# EAGLE design Un_Bus_B (EAGLE 7.1.0)
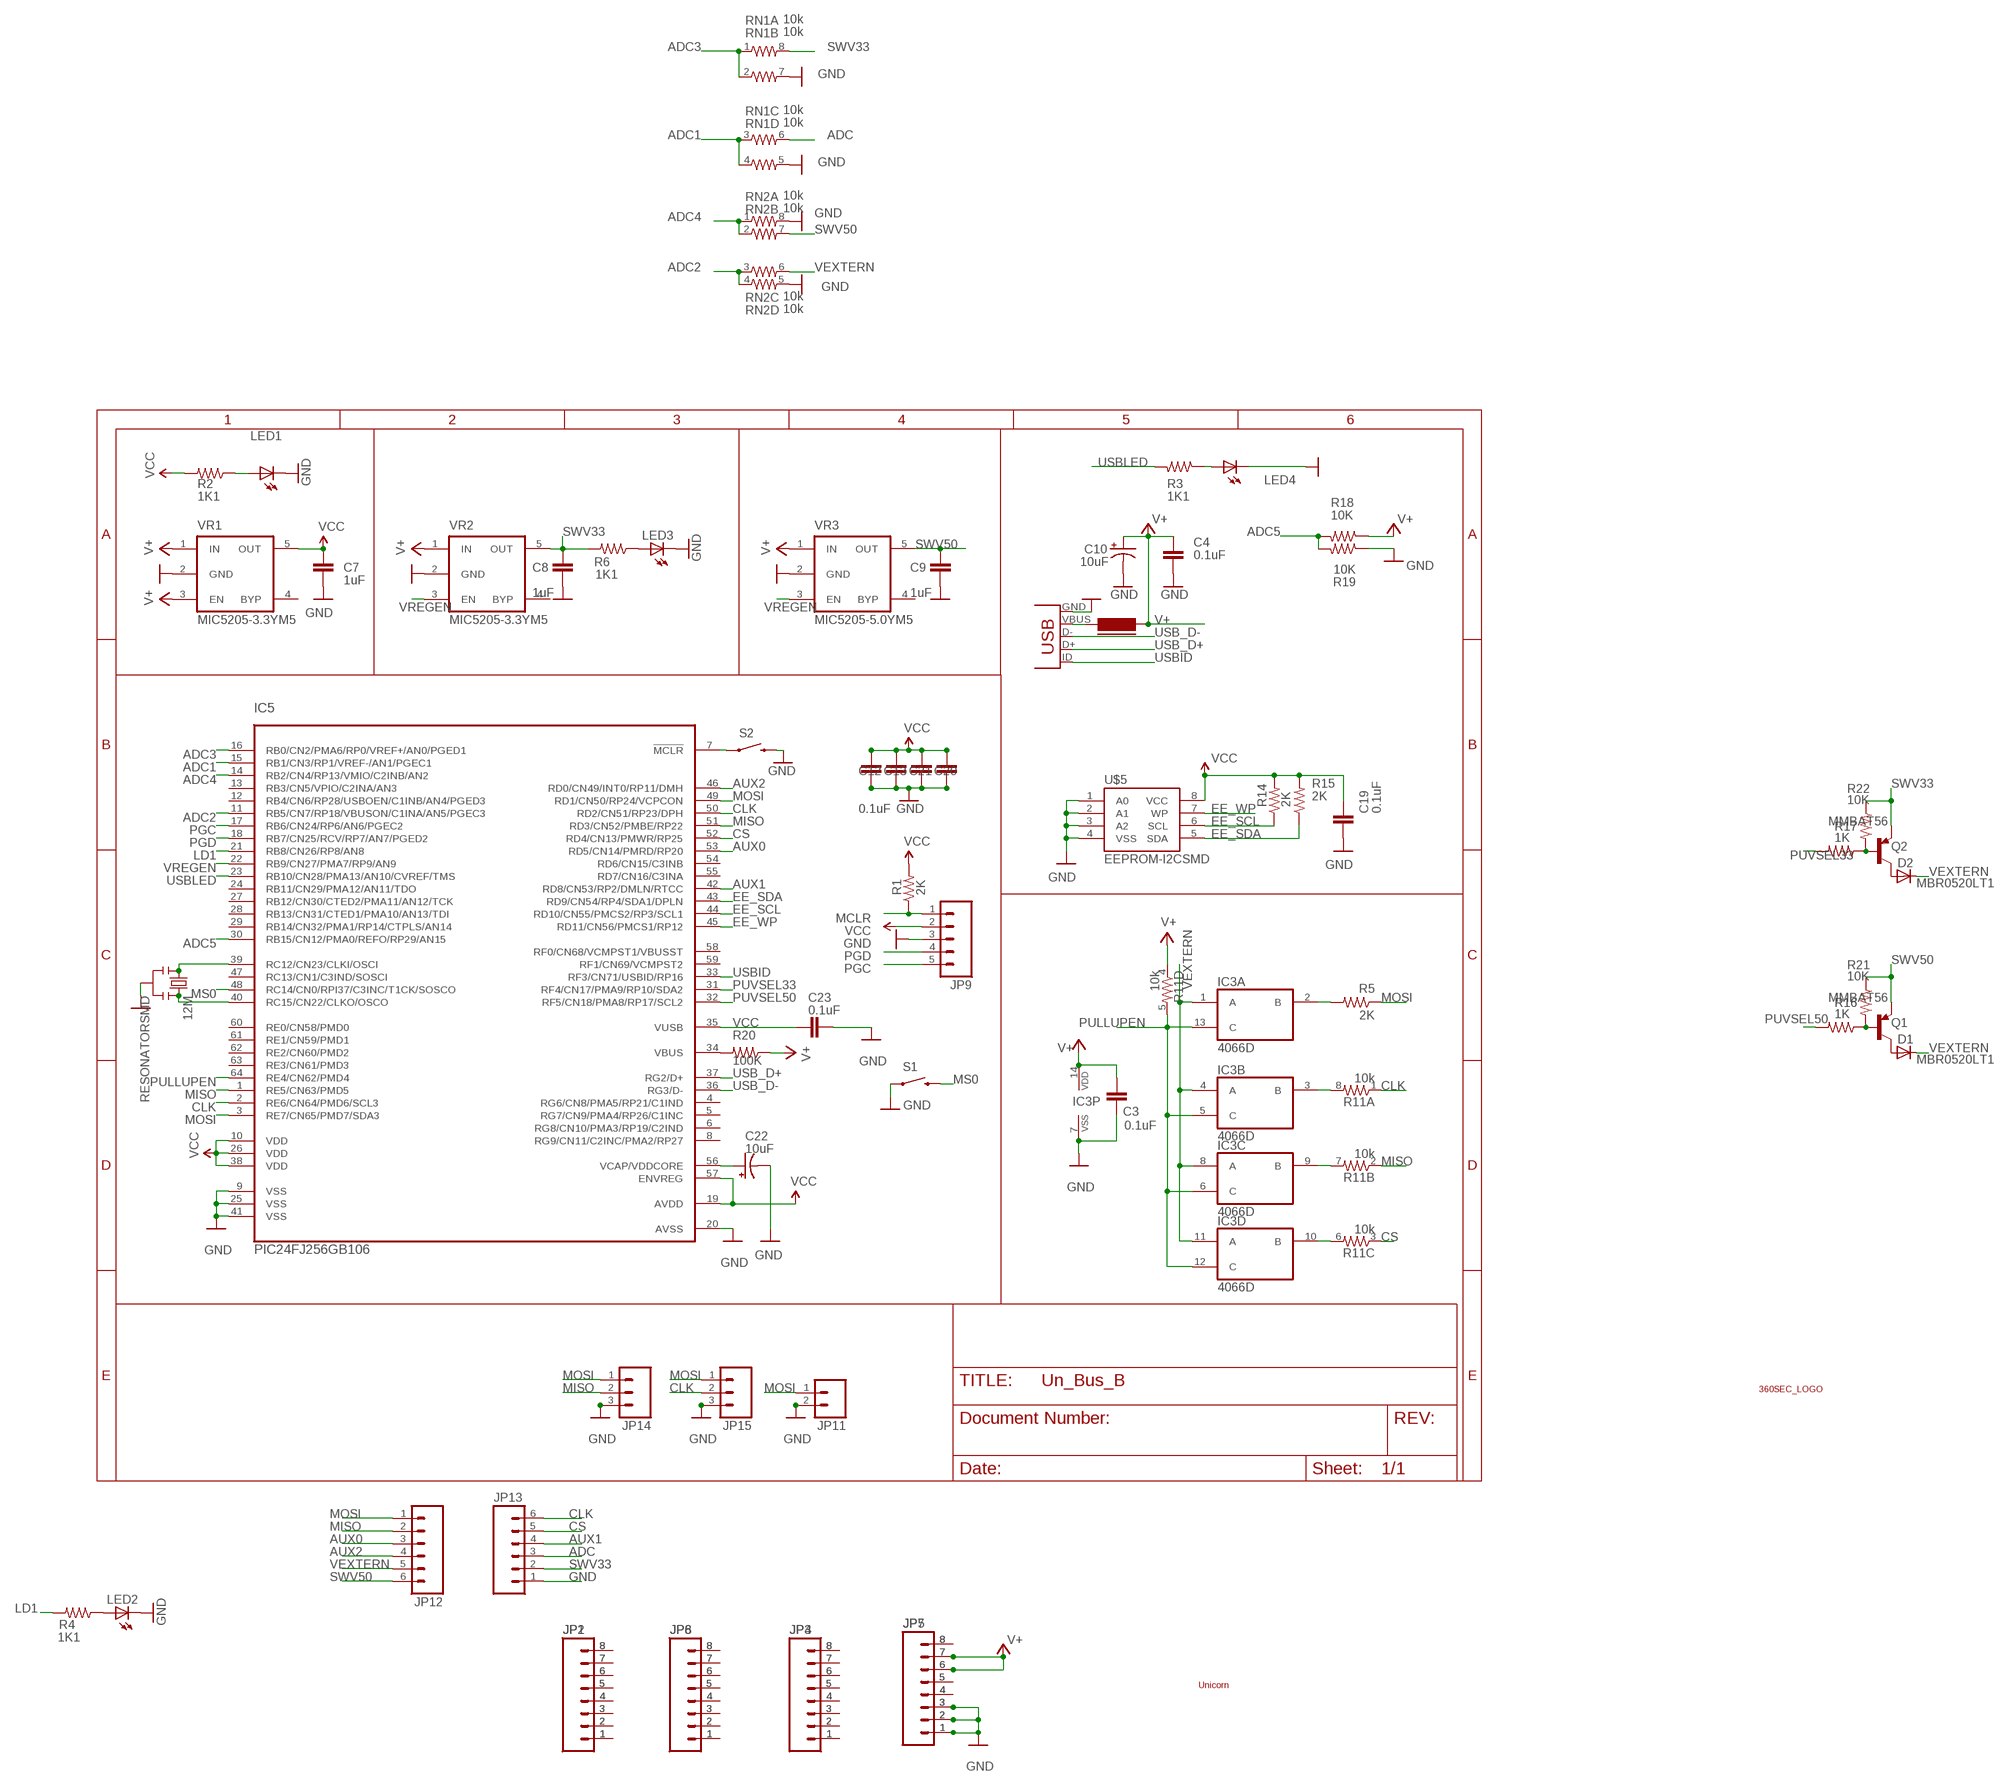
[diagram p0: schematic, sheet 1]

## Parts
12M  RESONATORSMD  [RESONATOR-SMD]
C3  0.1uF  CAP0603-CAP  [0603-CAP]
C4  0.1uF  CAP0603-CAP  [0603-CAP]
C7  1uF  CAP0603-CAP  [0603-CAP]
C8  1uF  CAP0603-CAP  [0603-CAP]
C9  1uF  CAP0603-CAP  [0603-CAP]
C10  10uF  CAP_POL1206  [EIA3216]
C12  0.1uF  CAP0603-CAP  [0603-CAP]
C13  0.1uF  CAP0603-CAP  [0603-CAP]
C19  0.1uF  CAP0603-CAP  [0603-CAP]
C20  0.1uF  CAP0603-CAP  [0603-CAP]
C21  0.1uF  CAP0603-CAP  [0603-CAP]
C22  10uF  CAP_POL1206  [EIA3216]
C23  0.1uF  CAP0603-CAP  [0603-CAP]
D1  MBR0520LT1  MBR0520LT  [SOD123]
D2  MBR0520LT1  MBR0520LT  [SOD123]
IC3  4066D  [SO14]
IC5  PIC24FJ256GB106  [TQFP64-10X10]
JP1  M081X08  [1X08]
JP2  M081X08  [1X08]
JP3  M081X08  [1X08]
JP4  M081X08  [1X08]
JP5  M081X08  [1X08]
JP6  M081X08  [1X08]
JP7  M081X08  [1X08]
JP8  M081X08  [1X08]
JP9  M05PTH  [1X05]
JP11  M02PTH  [1X02]
JP12  M06SIP  [1X06]
JP13  M06SIP  [1X06]
JP14  M03PTH  [1X03]
JP15  M03PTH  [1X03]
L1  700mA+ ferrite  FERRITE-0805  [FB805]
LED1  LED0805  [LED-0805]
LED2  LED0805  [LED-0805]
LED3  LED0805  [LED-0805]
LED4  LED0805  [LED-0805]
Q1  MMBAT56  MMBTA56-SOT23  [SOT23]
Q2  MMBAT56  MMBTA56-SOT23  [SOT23]
R1  2K  RESISTOR0603-RES  [0603-RES]
R2  1K1  RESISTOR0603-RES  [0603-RES]
R3  1K1  RESISTOR0603-RES  [0603-RES]
R4  1K1  RESISTOR0603-RES  [0603-RES]
R5  2K  RESISTOR0603-RES  [0603-RES]
R6  1K1  RESISTOR0603-RES  [0603-RES]
R11  10k  RESISTOR-ARRAY  [RES-NET-0603]
R14  2K  RESISTOR0603-RES  [0603-RES]
R15  2K  RESISTOR0603-RES  [0603-RES]
R16  1K  RESISTOR0603-RES  [0603-RES]
R17  1K  RESISTOR0603-RES  [0603-RES]
R18  10K  RESISTOR0603-RES  [0603-RES]
R19  10K  RESISTOR0603-RES  [0603-RES]
R20  100K  RESISTOR0603-RES  [0603-RES]
R21  10K  RESISTOR0603-RES  [0603-RES]
R22  10K  RESISTOR0603-RES  [0603-RES]
RN1  10k  RESISTOR-ARRAY  [RES-NET-0603]
RN2  10k  RESISTOR-ARRAY  [RES-NET-0603]
S1  SWITCH-MOMENTARY-2-SMD-1101NE  [TACTILE-SWITCH-1101NE]
S2  SWITCH-MOMENTARY-2-SMD-1101NE  [TACTILE-SWITCH-1101NE]
U$1  UNICORN  [UNICORN_1]
U$3  360SEC_LOGO_1  [360SEC_1]
U$5  EEPROM-I2CSMD  [SO08]
VR1  MIC5205-3.3YM5  MIC5205  [SOT-23-5]
VR2  MIC5205-3.3YM5  MIC5205  [SOT-23-5]
VR3  MIC5205-5.0YM5  MIC5205  [SOT-23-5]
X1  USBSMD  [USB-MINIB]

## Nets
ADC: JP13.3 RN1.6
ADC1: IC5.15(RB1/CN3/RP1/VREF-/AN1/PGEC1) RN1.3 RN1.4
ADC2: IC5.11(RB5/CN7/RP18/VBUSON/C1INA/AN5/PGEC3) RN2.3 RN2.4
ADC3: IC5.16(RB0/CN2/PMA6/RP0/VREF+/AN0/PGED1) RN1.1 RN1.2
ADC4: IC5.14(RB2/CN4/RP13/VMIO/C2INB/AN2) RN2.1 RN2.2
ADC5: IC5.30(RB15/CN12/PMA0/REFO/RP29/AN15) R18.2 R19.2
AUX0: IC5.53(RD5/CN14/PMRD/RP20) JP12.3
AUX1: IC5.42(RD8/CN53/RP2/DMLN/RTCC) JP13.4
AUX2: IC5.46(RD0/CN49/INT0/RP11/DMH) JP12.4
CLK: IC5.2(RE6/CN64/PMD6/SCL3) IC5.50(RD2/CN51/RP23/DPH) JP13.6 JP15.2 R11.1
CS: IC5.52(RD4/CN13/PMWR/RP25) JP13.5 R11.3
EE_SCL: IC5.44(RD10/CN55/PMCS2/RP3/SCL1) R14.1 U$5.6(SCL)
EE_SDA: IC5.43(RD9/CN54/RP4/SDA1/DPLN) R15.1 U$5.5(SDA)
EE_WP: IC5.45(RD11/CN56/PMCS1/RP12) U$5.7(WP)
GND: 12M.2 C3.2 C4.2 C7.2 C8.2 C9.2 C10.C(-) C12.2 C13.2 C19.1 C20.2 C21.2 C22.C(-) C23.2 IC3.7(P:VSS) IC5.9(VSS) IC5.20(AVSS) IC5.25(VSS) IC5.41(VSS) JP5.1 JP5.2 JP5.3 JP7.1 JP7.2 JP7.3 JP9.3 JP11.2 JP13.1 JP14.3 JP15.3 LED1.2(C) LED2.2(C) LED3.2(C) LED4.2(C) R19.1 RN1.5 RN1.7 RN2.5 RN2.8 S1.P$1 S2.P$2 U$5.1(A0) U$5.2(A1) U$5.3(A2) U$5.4(VSS) VR1.2(GND) VR2.2(GND) VR3.2(GND) X1.GND
LD1: IC5.21(RB8/CN26/RP8/AN8) R4.2
MCLR: IC5.7(!MCLR) JP9.1 R1.1 S2.P$1
MISO: IC5.1(RE5/CN63/PMD5) IC5.51(RD3/CN52/PMBE/RP22) JP12.2 JP14.2 R11.2
MOSI: IC5.3(RE7/CN65/PMD7/SDA3) IC5.49(RD1/CN50/RP24/VCPCON) JP11.1 JP12.1 JP14.1 JP15.1 R5.1
MS0: IC5.48(RC14/CN0/RPI37/C3INC/T1CK/SOSCO) S1.P$2
N$1: IC3.2(A:B) R5.2
N$2: IC3.3(B:B) R11.8
N$4: IC3.10(D:B) R11.6
N$5: IC3.9(C:B) R11.7
N$6: LED2.1(A) R4.1
N$7: LED1.1(A) R2.1
N$8: JP1.1 JP2.1
N$10: JP1.2 JP2.2
N$11: JP1.3 JP2.3
N$12: JP1.4 JP2.4
N$13: LED4.1(A) R3.1
N$14: JP1.5 JP2.5
N$17: JP1.6 JP2.6
N$18: LED3.1(A) R6.1
N$19: JP1.7 JP2.7
N$20: JP1.8 JP2.8
N$21: JP3.1 JP4.1
N$22: JP3.2 JP4.2
N$23: JP3.3 JP4.3
N$24: JP3.4 JP4.4
N$25: JP3.5 JP4.5
N$26: JP3.6 JP4.6
N$27: JP3.7 JP4.7
N$28: JP3.8 JP4.8
N$30: L1.1 X1.VBUS
N$31: JP5.4 JP7.4
N$32: JP6.1 JP8.1
N$33: JP5.5 JP7.5
N$34: JP6.2 JP8.2
N$35: JP6.3 JP8.3
N$36: JP6.4 JP8.4
N$37: JP6.5 JP8.5
N$38: JP6.6 JP8.6
N$39: JP6.7 JP8.7
N$40: JP6.8 JP8.8
N$49: C22.A(+) IC5.56(VCAP/VDDCORE)
N$50: IC5.34(VBUS) R20.2
N$51: 12M.3 IC5.40(RC15/CN22/CLKO/OSCO)
N$52: 12M.1 IC5.39(RC12/CN23/CLKI/OSCI)
N$53: D1.A Q1.3(C)
N$54: D2.A Q2.3(C)
N$55: Q1.1(B) R16.1 R21.2
N$56: Q2.1(B) R17.1 R22.2
PGC: IC5.17(RB6/CN24/RP6/AN6/PGEC2) JP9.5
PGD: IC5.18(RB7/CN25/RCV/RP7/AN7/PGED2) JP9.4
PULLUPEN: IC3.5(B:C) IC3.6(C:C) IC3.12(D:C) IC3.13(A:C) IC5.64(RE4/CN62/PMD4) R11.5
PUVSEL33: IC5.31(RF4/CN17/PMA9/RP10/SDA2) R17.2
PUVSEL50: IC5.32(RF5/CN18/PMA8/RP17/SCL2) R16.2
RST: JP5.8 JP7.8
SWV33: C8.1 JP13.2 Q2.2(E) R6.2 R22.1 RN1.8 VR2.5(OUT)
SWV50: C9.1 JP12.6 Q1.2(E) R21.1 RN2.7 VR3.5(OUT)
USB_D+: IC5.37(RG2/D+) X1.D+
USB_D-: IC5.36(RG3/D-) X1.D-
USBID: IC5.33(RF3/CN71/USBID/RP16) X1.ID(USBID)
USBLED: IC5.23(RB10/CN28/PMA13/AN10/CVREF/TMS) R3.2
V+: C3.1 C4.1 C10.A(+) IC3.14(P:VDD) JP5.6 JP5.7 JP7.6 JP7.7 L1.2 R11.4 R18.1 R20.1 VR1.1(IN) VR1.3(EN) VR2.1(IN) VR3.1(IN)
VCC: C7.1 C12.1 C13.1 C19.2 C20.1 C21.1 C23.1 IC5.10(VDD) IC5.19(AVDD) IC5.26(VDD) IC5.35(VUSB) IC5.38(VDD) IC5.57(ENVREG) JP9.2 R1.2 R2.2 R14.2 R15.2 U$5.8(VCC) VR1.5(OUT)
VEXTERN: D1.C D2.C IC3.1(A:A) IC3.4(B:A) IC3.8(C:A) IC3.11(D:A) JP12.5 RN2.6
VREGEN: IC5.22(RB9/CN27/PMA7/RP9/AN9) VR2.3(EN) VR3.3(EN)
Unconnected: IC5.4(RG6/CN8/PMA5/RP21/C1IND) IC5.5(RG7/CN9/PMA4/RP26/C1INC) IC5.6(RG8/CN10/PMA3/RP19/C2IND) IC5.8(RG9/CN11/C2INC/PMA2/RP27) IC5.12(RB4/CN6/RP28/USBOEN/C1INB/AN4/PGED3) IC5.13(RB3/CN5/VPIO/C2INA/AN3) IC5.24(RB11/CN29/PMA12/AN11/TDO) IC5.27(RB12/CN30/CTED2/PMA11/AN12/TCK) IC5.28(RB13/CN31/CTED1/PMA10/AN13/TDI) IC5.29(RB14/CN32/PMA1/RP14/CTPLS/AN14) IC5.47(RC13/CN1/C3IND/SOSCI) IC5.54(RD6/CN15/C3INB) IC5.55(RD7/CN16/C3INA) IC5.58(RF0/CN68/VCMPST1/VBUSST) IC5.59(RF1/CN69/VCMPST2) IC5.60(RE0/CN58/PMD0) IC5.61(RE1/CN59/PMD1) IC5.62(RE2/CN60/PMD2) IC5.63(RE3/CN61/PMD3) VR1.4(BYP) VR2.4(BYP) VR3.4(BYP)

## Library data of the parts
12M = 2SparkFun:RESONATOR: Resonator Small SMD resonator. This is the itty bitty 10/20MHz resonators with built in caps. CSTCE10M0G55 and CSTCE20M0V53. Footprint has been reviewed closely but hasn't been tested yet.
C3 C4 C7-C9 C12 C13 C19-C21 C23 = 2SparkFun:CAP: Capacitor Standard 0603 ceramic capacitor, and 0.1" leaded capacitor.
C10 C22 = 2SparkFun:CAP_POL: Capacitor Polarized These are standard SMD and PTH capacitors. Normally 10uF, 47uF, and 100uF in electrolytic and tantalum varieties. Always verify the external diameter of the through hole cap, it varies with capacity, voltage, and manufacturer. The EIA devices should be standard.
D1 D2 = diode:MBR0520LT: SCHOTTKY BARRIER RECTIFIER Source: http://onsemi.com .. MBR0520LT1-D.pdf
IC3 = 40xx:4066: Quad bilateral ANALOG SWITCH
IC5 = dp_devices:PIC24FJ256GB106: 16-Bit Flash Microcontroller with USB On-The-Go(OTG)
JP1-JP8 = 2SparkFun:M08: Header 8 Standard 8-pin 0.1" header. Use with straight break away headers (SKU : PRT-00116), right angle break away headers (PRT-00553), swiss pins (PRT-00743), machine pins (PRT-00117), and female headers (PRT-00115).
JP9 = 2SparkFun:M05: Header 5 Standard 5-pin 0.1" header. Use with straight break away headers (SKU : PRT-00116), right angle break away headers (PRT-00553), swiss pins (PRT-00743), machine pins (PRT-00117), and female headers (PRT-00115). Molex polarized connector foot print use with SKU : PRT-08230 with associated crimp pins and housings.
JP11 = 2SparkFun:M02: Header 2 Standard 2-pin 0.1" header. Use with straight break away headers (SKU : PRT-00116), right angle break away headers (PRT-00553), swiss pins (PRT-00743), machine pins (PRT-00117), and female headers (PRT-00115). Molex polarized connector foot print use with SKU : PRT-08233 with associated crimp pins and housings.
JP12 JP13 = 2SparkFun:M06: Header 6 Standard 6-pin 0.1" header. Use with straight break away headers (SKU : PRT-00116), right angle break away headers (PRT-00553), swiss pins (PRT-00743), machine pins (PRT-00117), and female headers (PRT-00115). Molex polarized connector foot print use with SKU : PRT-08094 with associated crimp pins and housings. NOTES ON THE VARIANTS LOCK and LOCK_LONGPADS... This footprint was designed to help hold the alignment of a through-hole component (i.e. 6-pin header) while soldering it into place. You may notice that each hole has been shifted either up or down by 0.005 of an inch from it's more standard position (which is a perfectly straight line). This slight alteration caused the pins (the squares in the middle) to touch the edges of the holes. Because they are alternating, it causes a "brace" to hold the component in place. 0.005 has proven to be the perfect amount of "off-center" position when using our standard breakaway headers. Although looks a little odd when you look at the bare footprint, once you have a header in there, the alteration is very hard to notice. Also, if you push a header all the way into place, it is covered up entirely on the bottom side. This idea of altering the position of holes to aid alignment will be further integrated into the Sparkfun Library for other footprints. It can help hold any component with 3 or more connection pins.
JP14 JP15 = 2SparkFun:M03: Header 3 Standard 3-pin 0.1" header. Use with straight break away headers (SKU : PRT-00116), right angle break away headers (PRT-00553), swiss pins (PRT-00743), machine pins (PRT-00117), and female headers (PRT-00115). Molex polarized connector foot print use with SKU : PRT-08232 with associated crimp pins and housings.
L1 = 2SparkFun:FERRITE: Ferrite bead in various packages
LED1-LED4 = 2SparkFun:LED: LEDs Standard schematic elements and footprints for 5mm, 3mm, 1206, and 0603 sized LEDs. 5mm - Spark Fun Electronics SKU : COM-00529 (and others)
Q1 Q2 = transistor-pnp:*-?: PNP Transistor
R1 R5 R14-R22 = 2SparkFun:RESISTOR: Resistor
R2-R4 R6 = 1SparkFun:RESISTOR: Resistor
R11 RN1 RN2 = 2SparkFun:RESISTOR-ARRAY: Array Chip Resistor Source: RS Component / Phycomp
S1 S2 = 2SparkFun:SWITCH-MOMENTARY-2
U$1 = 2SparkFun:UNICORN
U$3 = 2SparkFun:360SEC_LOGO
U$5 = 2SparkFun:EEPROM-I2C
VR1-VR3 = dp_devices:MIC5205: 150ma Low-Noise LDO Regulator
X1 = 2SparkFun:USB: USB Connectors USB-B-PTH is fully proven SKU : PRT-00139 USB-miniB is fully proven SKU : PRT-00587 USB-A-PCB is untested. USB-A-H is throughly reviewed, but untested. Spark Fun Electronics SKU : PRT-00437 USB-B-SMT is throughly reviewed, but untested. Needs silkscreen touching up. USB-A-S has not been used/tested USB-MB-H has not been used/tested

## Net classes
2 gnd: width 0.305 mm, drill 0.559 mm, clearance 0.254 mm

## Board
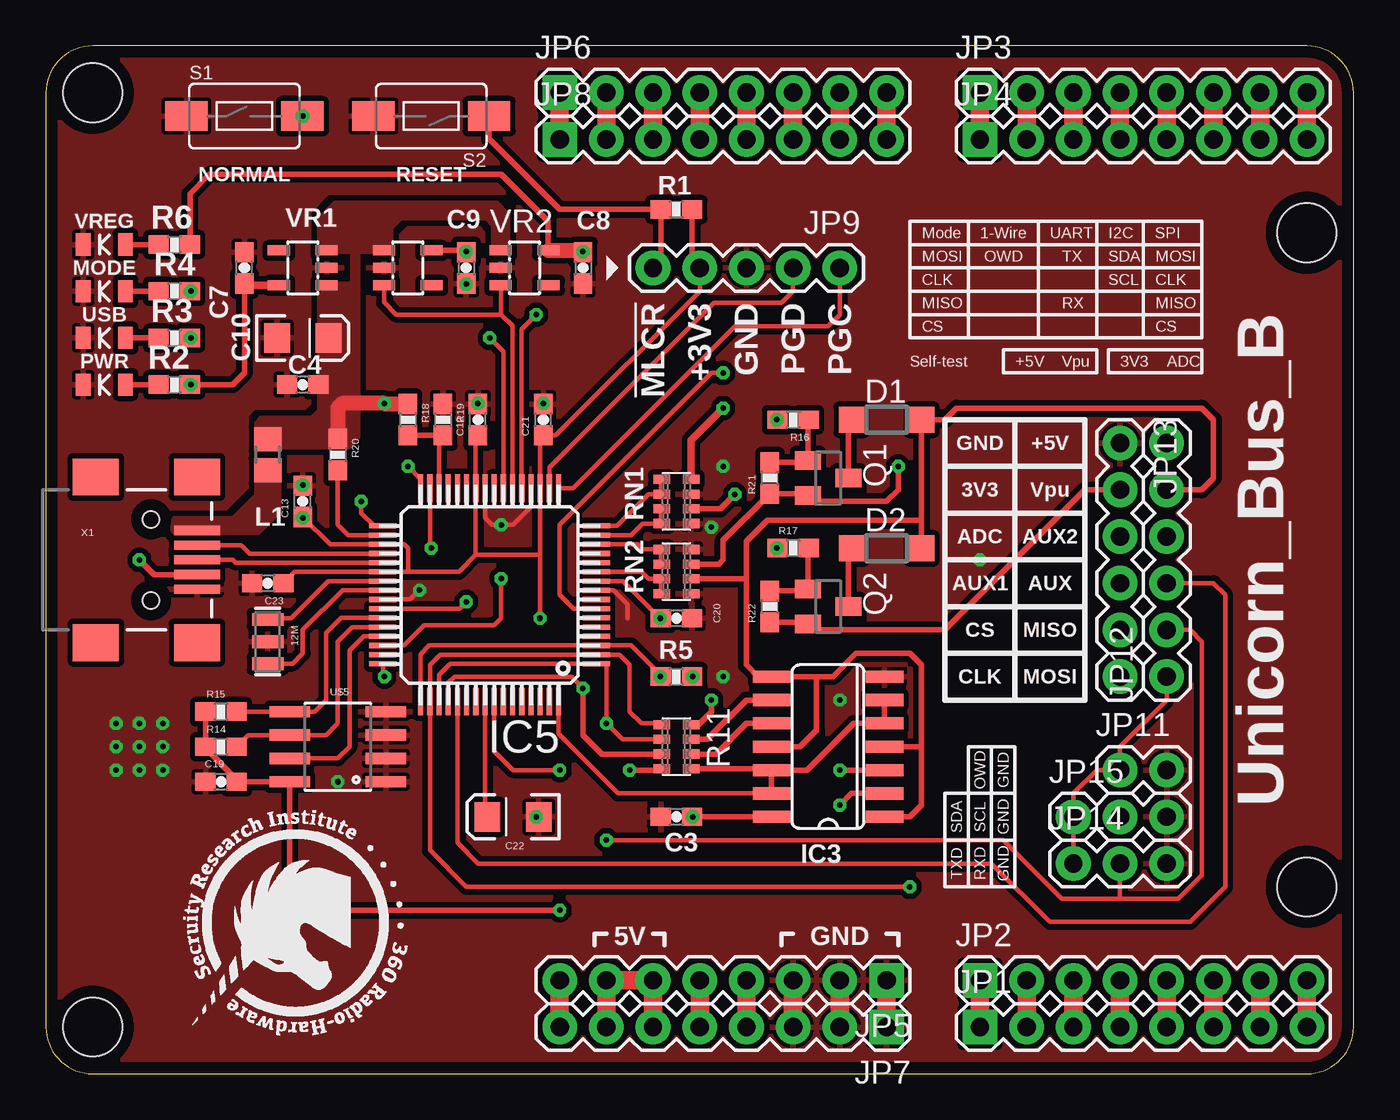
[diagram p1: board, top side]
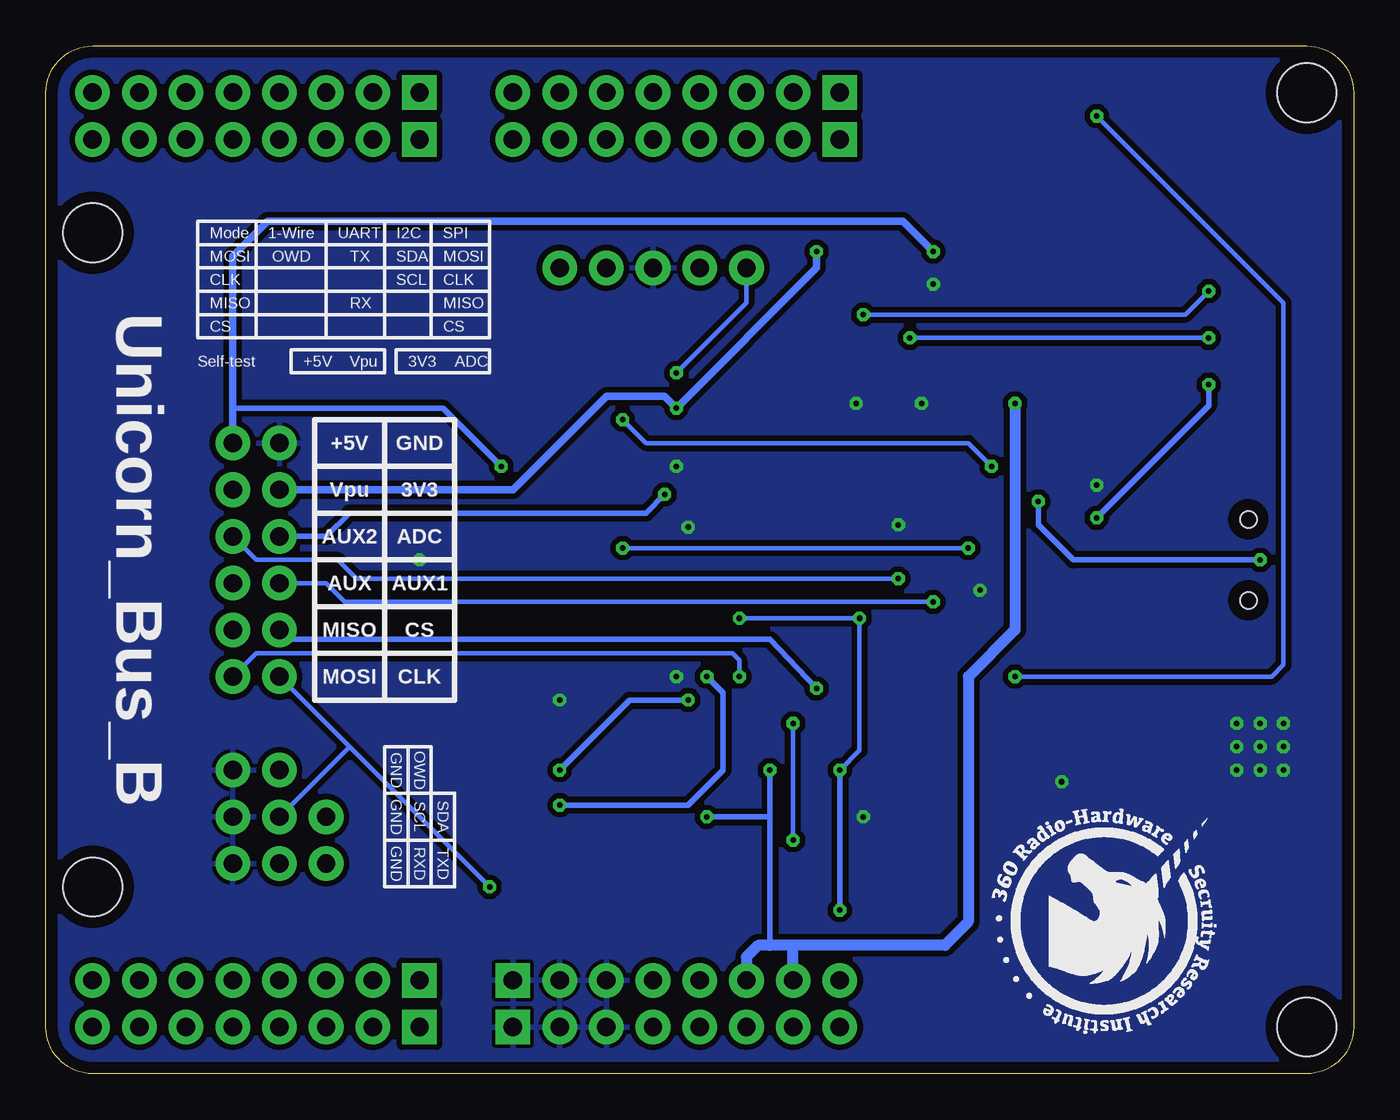
[diagram p2: board, bottom side, seen from below]

Size 71.12 x 55.88 mm. Coordinates in mm from the lower left corner, seen from the top.
Copper layers (1*16): Top 0.035mm / dielectric 1.5mm / Bottom 0.035mm
Design rules "yun": minimum track width 8mil, minimum drill 15mil, track to track 8mil, track to pad 8mil, pad to pad 8mil, via to via 8mil, smd to smd 8mil, copper to edge 25mil, drill to drill 8mil, minimum pad ring 10mil, minimum via ring 8mil, stop-mask expansion 4mil, vias tented up to drill 20mil, thermal gap 8mil

### Footprints (pad centres in the part's own frame; a part is rotated, then mirrored left to right if it is on the bottom)
RESONATOR-SMD = smd 0.7 x 1.7: 1 -1.2,0; 2 0,0; 3 1.2,0
0603-CAP = smd 1.1 x 1: 1 -0.85,0; 2 0.85,0
EIA3216 = smd 1.4 x 1.6: A 1.4,0; C -1.4,0
SOD123 = smd 1.4 x 1.4: A 1.9,0; C -1.9,0
SO14 = smd 0.66 x 2.032: 1 -3.81,-3.073; 2 -2.54,-3.073; 3 -1.27,-3.073; 4 0,-3.073; 5 1.27,-3.073; 6 2.54,-3.073; 7 3.81,-3.073; 8 3.81,3.073; 9 2.54,3.073; 10 1.27,3.073; 11 0,3.073; 12 -1.27,3.073; 13 -2.54,3.073; 14 -3.81,3.073
TQFP64-10X10 = smd 1.5 x 0.28: 1 -5.8,3.75; 2 -5.8,3.25; 3 -5.8,2.75; 4 -5.8,2.25; 5 -5.8,1.75; 6 -5.8,1.25; 7 -5.8,0.75; 8 -5.8,0.25; 9 -5.8,-0.25; 10 -5.8,-0.75; 11 -5.8,-1.25; 12 -5.8,-1.75; 13 -5.8,-2.25; 14 -5.8,-2.75; 15 -5.8,-3.25; 16 -5.8,-3.75; 33 5.8,-3.75; 34 5.8,-3.25; 35 5.8,-2.75; 36 5.8,-2.25; 37 5.8,-1.75; 38 5.8,-1.25; 39 5.8,-0.75; 40 5.8,-0.25; 41 5.8,0.25; 42 5.8,0.75; 43 5.8,1.25; 44 5.8,1.75; 45 5.8,2.25; 46 5.8,2.75; 47 5.8,3.25; 48 5.8,3.75 | smd 0.28 x 1.5: 17 -3.75,-5.8; 18 -3.25,-5.8; 19 -2.75,-5.8; 20 -2.25,-5.8; 21 -1.75,-5.8; 22 -1.25,-5.8; 23 -0.75,-5.8; 24 -0.25,-5.8; 25 0.25,-5.8; 26 0.75,-5.8; 27 1.25,-5.8; 28 1.75,-5.8; 29 2.25,-5.8; 30 2.75,-5.8; 31 3.25,-5.8; 32 3.75,-5.8; 49 3.75,5.8; 50 3.25,5.8; 51 2.75,5.8; 52 2.25,5.8; 53 1.75,5.8; 54 1.25,5.8; 55 0.75,5.8; 56 0.25,5.8; 57 -0.25,5.8; 58 -0.75,5.8; 59 -1.25,5.8; 60 -1.75,5.8; 61 -2.25,5.8; 62 -2.75,5.8; 63 -3.25,5.8; 64 -3.75,5.8
1X08 = drill 1 pad 1.88 square: 1 0,0 | drill 1 pad 1.88: 2 2.54,0; 3 5.08,0; 4 7.62,0; 5 10.16,0; 6 12.7,0; 7 15.24,0; 8 17.78,0
1X05 = drill 1 pad 1.88: 1 0,0; 2 2.54,0; 3 5.08,0; 4 7.62,0; 5 10.16,0
1X02 = drill 1 pad 1.88: 1 0,0; 2 2.54,0
1X06 = drill 1 pad 1.88: 1 0,0; 2 2.54,0; 3 5.08,0; 4 7.62,0; 5 10.16,0; 6 12.7,0
1X03 = drill 1 pad 1.88: 1 0,0; 2 2.54,0; 3 5.08,0
FB805 = smd 1.3 x 1.5: 1 -0.85,0; 2 0.85,0
LED-0805 = smd 0.8 x 1.2: 1 -1.154,0; 2 1.154,0
SOT23 = smd 1 x 1.4: 1 -0.95,-1.1; 2 0.95,-1.1; 3 0,1.1
0603-RES = smd 1.1 x 1: 1 -0.85,0; 2 0.85,0
RES-NET-0603 = smd 0.5 x 0.9: 1 -1.2,-0.8; 2 -0.4,-0.8; 3 0.4,-0.8; 4 1.2,-0.8; 5 1.2,0.8; 6 0.4,0.8; 7 -0.4,0.8; 8 -1.2,0.8
TACTILE-SWITCH-1101NE = smd 2.3 x 1.6: P$1 -3.15,0; P$2 3.15,0
UNICORN_1 = hole 3.2: -30.48,-25.4; 35.56,17.78; 35.56,-17.78; -30.48,25.4
SO08 = smd 0.61 x 2.21: 1 -1.905,-2.616; 2 -0.635,-2.616; 3 0.635,-2.616; 4 1.905,-2.616; 5 1.905,2.616; 6 0.635,2.616; 7 -0.635,2.616; 8 -1.905,2.616
SOT-23-5 = smd 0.55 x 1.2: 1 -0.95,-1.3; 2 0,-1.3; 3 0.95,-1.3; 4 0.95,1.3; 5 -0.95,1.3
USB-MINIB = smd 2.5 x 0.5: D+ 2.5,0; D- 2.5,0.8; GND 2.5,-1.6; ID 2.5,-0.8; VBUS 2.5,1.6 | smd 2.5 x 2: MTN1 -3,4.5; MTN2 2.5,4.5; MTN3 -3,-4.5; MTN4 2.5,-4.5 | hole 0.9: 0,2.2; 0,-2.2

### Placement (x,y rotation side)
12M  12.06,23.5 270 top
C3  34.29,13.97 180 top
C4  13.97,37.47 180 top
C7  10.79,43.81 90 top
C8  29.21,43.81 270 top
C9  22.86,43.81 270 top
C10  13.97,40.01 0 top
C12  23.5,35.56 90 top
C13  13.97,31.11 90 top
C19  9.53,15.88 0 top
C20  34.29,24.77 0 top
C21  27.05,35.56 90 top
C22  25.4,13.97 180 top
C23  12.06,26.67 180 top
D1  45.72,35.56 180 top
D2  45.72,28.57 180 top
IC3  42.55,17.78 90 top
IC5  24.13,26.04 180 top
JP1  50.8,2.54 0 top
JP2  50.8,5.08 0 top
JP3  50.8,53.34 0 top
JP4  50.8,50.8 0 top
JP5  45.72,5.08 180 top
JP6  27.94,53.34 0 top
JP7  45.72,2.54 180 top
JP8  27.94,50.8 0 top
JP9  33.02,43.81 0 top
JP11  58.42,16.51 0 top
JP12  60.96,21.59 90 top
JP13  58.42,34.29 270 top
JP14  55.88,11.43 0 top
JP15  55.88,13.97 0 top
L1  12.06,33.66 90 top
LED1  3.17,37.47 180 top
LED2  3.17,42.55 180 top
LED3  3.17,45.09 180 top
LED4  3.17,40.01 180 top
Q1  42.55,32.38 270 top
Q2  42.55,25.4 270 top
R1  34.29,46.99 0 top
R2  6.99,37.47 0 top
R3  6.99,40.01 0 top
R4  6.99,42.55 0 top
R5  34.29,21.59 0 top
R6  6.99,45.09 0 top
R11  34.29,17.78 270 top
R14  9.53,17.78 180 top
R15  9.53,19.68 180 top
R16  40.64,35.56 180 top
R17  40.64,28.57 180 top
R18  19.68,35.56 270 top
R19  21.59,35.56 270 top
R20  15.88,33.66 270 top
R21  39.37,32.38 90 top
R22  39.37,25.4 90 top
RN1  34.29,31.11 270 top
RN2  34.29,27.3 270 top
S1  10.79,52.07 0 top
S2  20.95,52.07 180 top
U$1  33.02,27.94 0 top
U$3  20.32,1.91 90 top
U$4  360SEC_LOGO_1  [360SEC_1]  20.32,14.61 270 bottom
U$5  15.88,17.78 90 top
VR1  13.97,43.81 90 top
VR2  26.04,43.81 270 top
VR3  19.68,43.81 270 top
X1  5.71,27.94 0 top

### Tracks (layer width: path | path; a pad name or v marks a point on that pad's centre or on a via)
ADC  (via drill 0.3)
  Top 0.305: RN1.6 36.68,30.71 v37.47,31.5
  Bottom 0.305: v37.47,31.5 38.48,30.48 54.61,30.48 55.88,29.21 JP13.3
ADC1
  Top 0.254: RN1.4 32.45,29.91 31.82,29.29 IC5.15
  Top 0.305: RN1.4 RN1.3
ADC2
  Top 0.254: IC5.11 32.41,27.29 32.78,26.91 RN2.3
  Top 0.305: RN2.3 RN2.4
ADC3
  Top 0.254: RN1.2 32.78,31.52 31.05,29.79 IC5.16
  Top 0.305: RN1.2 RN1.1
ADC4
  Top 0.254: RN2.1 32.45,28.5 32.17,28.79 IC5.14
  Top 0.305: RN2.2 RN2.1
ADC5
  Top 0.254: IC5.30 21.38,34.5 R19.2
  Top 0.305: R18.2 R19.2
AUX0
  Top 0.254: IC5.53 22.38,12.54 23.5,11.43 51.44,11.43 54.61,8.26 62.23,8.26 64.14,10.16 64.14,26.04 63.5,26.67 JP12.3
AUX1  (via drill 0.3)
  Top 0.254: IC5.42 22.49,25.29 v22.86,25.65
  Bottom 0.254: v22.86,25.65 54.86,25.65 55.88,26.67 JP13.4
AUX2  (via drill 0.3)
  Top 0.254: IC5.46 19.48,23.29 20.57,24.38 24.38,24.38 24.77,24.77 v24.77,26.92
  Bottom 0.254: v24.77,26.92 54.23,26.92 55.24,27.94 59.69,27.94 JP12.4
CLK  (via drill 0.3)
  Top 0.254: R11.1 33.42,19.05 32.38,19.05 31.75,19.68 31.75,22.23 31.19,22.79 IC5.2 21.44,22.79 20.88,22.23 IC5.50 20.88,12.14 22.86,10.16 v46.99,10.16
  Bottom 0.254: v46.99,10.16 54.61,17.78 | 54.61,17.78 JP13.6 | JP15.2 54.61,17.78
CS  (via drill 0.3)
  Top 0.254: IC5.52 21.88,21.25 22.23,21.59 28.57,21.59 v29.21,20.95
  Top 0.305: R11.3 30.25,17.38 29.21,18.41 v29.21,20.95
  Bottom 0.305: v29.21,20.95 31.75,23.62 57.91,23.62 JP13.5
EE_SCL
  Top 0.254: IC5.44 16.66,24.29 15.88,23.5 15.88,19.05 15.24,18.41 U$5.6 11.01,18.41 R14.1
EE_SDA
  Top 0.254: IC5.43 16.05,24.79 15.24,23.98 15.24,20.32 14.61,19.68 U$5.5 R15.1
EE_WP
  Top 0.254: IC5.45 17.28,23.79 16.51,23.01 16.51,17.78 15.88,17.14 U$5.7
GND  (via drill 0.3)
  Top 0.254: IC5.25 23.88,30.22 24.26,29.84 v24.77,29.84 25.4,29.84 26.38,30.82 IC5.20 | IC5.9 30.86,26.29 31.62,25.53 31.62,24.77 | IC5.41 19.82,25.79 v20.32,26.29
  Top 0.305: LED4.2 1.91,39.89
  Top 1.016: JP7.3 JP5.3 | JP7.2 JP5.2 | JP7.1 JP5.1
  other vias: 3.81,19.05 5.08,19.05 6.35,19.05 6.35,17.78 5.08,17.78 3.81,17.78 3.81,16.51 5.08,16.51 6.35,16.51 22.86,42.93 43.18,20.32 27.05,36.45 23.5,36.45 13.97,32 26.67,13.97 36.2,29.72 15.88,15.88 50.8,27.94 36.83,33.02 36.83,21.59
  pour Top (isolate 0.305, rank 2): 0,0 70.92,0 71.12,0.2 71.12,55.88 0.2,55.88 0,55.68
  pour Bottom (isolate 0.305, rank 2): 0,0 70.92,0 71.12,0.2 71.12,55.88 0.2,55.88 0,55.68
LD1  (via drill 0.3)
  Top 0.254: IC5.21 25.88,40.48 v26.67,41.27 | v7.87,42.55 R4.2
  Bottom 0.254: v26.67,41.27 9.14,41.27 v7.87,42.55
MCLR  (via drill 0.3)
  Top 0.254: v36.83,38.1 36.2,38.1 27.94,29.84 27.94,26.04 28.69,25.29 IC5.7
  Top 0.305: S2.P$1 24.11,50.83 27.94,46.99 R1.1 33.44,44.23 JP9.1
  Bottom 0.254: JP9.1 33.02,41.91 v36.83,38.1
MISO  (via drill 0.3)
  Top 0.254: IC5.51 21.38,21.68 21.98,22.29 IC5.1 30.48,22.29 v30.48,19.05 31.35,18.18 R11.2 | JP12.2 62.23,24.13 62.87,23.5 62.87,10.79 61.59,9.53 58.42,9.53 | v30.48,12.7 52.07,12.7 55.24,9.53 58.42,9.53 | JP14.2 58.42,9.53
  Bottom 0.254: v30.48,12.7 v30.48,19.05
MOSI  (via drill 0.3)
  Top 0.254: IC5.49 20.38,22.82 20.85,23.29 IC5.3 31.83,23.29 33.4,21.72 v33.4,21.59 R5.1 | JP14.1 JP15.1 55.88,15.24 57.15,16.51 JP11.1 58.42,17.78 60.96,20.32 JP12.1
  Bottom 0.254: JP12.1 59.69,22.86 33.78,22.86 33.4,22.48 v33.4,21.59
MS0  (via drill 0.3)
  Top 0.254: IC5.48 18.33,21.68 v18.41,21.59 | S1.P$2 v13.97,52.07
  Bottom 0.254: v18.41,21.59 4.45,21.59 3.81,22.23 3.81,41.91 v13.97,52.07
N$1  (via drill 0.3)
  Top 0.305: v43.18,14.61 43.81,15.24 IC3.2 | v35.18,21.59 R5.2
  Bottom 0.305: v43.18,14.61 36.2,14.61 34.29,16.51 34.29,20.7 v35.18,21.59
N$2  (via drill 0.3)
  Top 0.305: IC3.3 v43.18,16.51 | R11.8 35.49,18.98 36.2,19.68 v36.2,20.32
  Bottom 0.305: v43.18,16.51 39.37,20.32 v36.2,20.32
N$4
  Top 0.305: R11.6 36.43,17.38 38.1,19.05 IC3.10
N$5
  Top 0.305: R11.7 35.96,18.18 38.1,20.32 IC3.9
N$6
  Top 0.305: LED2.1 R4.1
N$7
  Top 0.305: R2.1 LED1.1
N$8
  Top 1.016: JP1.1 JP2.1
N$10
  Top 1.016: JP1.2 JP2.2
N$11
  Top 1.016: JP1.3 JP2.3
N$12
  Top 1.016: JP1.4 JP2.4
N$13
  Top 0.305: R3.1 LED4.1
N$14
  Top 1.016: JP1.5 JP2.5
N$17
  Top 1.016: JP1.6 JP2.6
N$18
  Top 0.305: LED3.1 R6.1
N$19
  Top 1.016: JP1.7 JP2.7
N$20
  Top 1.016: JP1.8 JP2.8
N$21
  Top 1.016: JP3.1 JP4.1
N$22
  Top 1.016: JP4.2 JP3.2
N$23
  Top 1.016: JP4.3 JP3.3
N$24
  Top 1.016: JP4.4 JP3.4
N$25
  Top 1.016: JP4.5 JP3.5
N$26
  Top 1.016: JP4.6 JP3.6
N$27
  Top 1.016: JP4.7 JP3.7
N$28
  Top 1.016: JP3.8 JP4.8
N$30
  pour Top (isolate 0.305, no thermals): 6.99,29.39 11.56,29.39 12.7,30.53 12.7,33.27 11.43,33.27 11.43,31.5 10.16,30.23 6.99,30.23 6.86,30.1 6.86,29.51
N$31
  Top 1.016: JP7.4 JP5.4
N$32
  Top 1.016: JP8.1 JP6.1
N$33
  Top 1.016: JP7.5 JP5.5
N$34
  Top 1.016: JP8.2 JP6.2
N$35
  Top 1.016: JP8.3 JP6.3
N$36
  Top 1.016: JP8.4 JP6.4
N$37
  Top 1.016: JP8.5 JP6.5
N$38
  Top 1.016: JP8.6 JP6.6
N$39
  Top 1.016: JP8.7 JP6.7
N$40
  Top 1.016: JP8.8 JP6.8
N$49
  Top 0.254: IC5.56 23.88,14.09 C22.A
N$50
  Top 0.254: IC5.34 16.43,29.29 15.88,29.84 R20.2
N$51
  Top 0.254: IC5.40 16.12,26.29 13.97,24.13 13.97,22.86 13.4,22.3 12M.3
N$52
  Top 0.254: IC5.39 15.36,26.79 13.34,24.77 11.5,24.77 12M.1
N$53
  Top 0.305: Q1.3 43.65,35.38 D1.A
N$54
  Top 0.305: Q2.3 43.65,28.4 D2.A
N$55
  Top 0.305: R16.1 41.45,35.52 Q1.1 41.34,33.23 R21.2
N$56
  Top 0.305: R17.1 41.45,28.53 Q2.1 41.34,26.25 R22.2
PGC
  Top 0.254: IC5.17 28.66,31.84 37.47,40.64 42.55,40.64 43.18,41.27 JP9.5
PGD
  Top 0.254: IC5.18 27.38,32.97 36.32,41.91 40.01,41.91 40.64,42.55 JP9.4
PULLUPEN
  Top 0.254: IC5.64 27.88,18.48 31.11,15.24 IC3.13
  Top 0.305: IC3.6 IC3.5 43.94,19.05 41.4,16.51 40.01,16.51 | IC3.13 IC3.12 40.01,16.51 | R11.5 39.94,16.58 40.01,16.51
PUVSEL33  (via drill 0.3)
  Top 0.254: IC5.31 20.88,28.65 v20.95,28.57 | v39.75,28.57 R17.2
  Bottom 0.254: v20.95,28.57 v39.75,28.57
PUVSEL50  (via drill 0.3)
  Top 0.254: IC5.32 20.38,32.33 v19.68,33.02 | v39.75,35.56 R16.2
  Bottom 0.254: v39.75,35.56 38.48,34.29 20.95,34.29 v19.68,33.02
RST
  Top 1.016: JP5.8 JP7.8
SWV33  (via drill 0.3)
  Top 0.305: R22.1 41.34,24.55 Q2.2 41.77,24.13 48.9,24.13 56.52,31.75 JP13.2 | R6.2 7.83,47.84 8.89,48.9 24.77,48.9 27.3,46.35 27.3,44.8 VR2.5 | v29.21,44.7 C8.1
  Top 0.406: RN1.8 35.09,34.45 v36.83,36.2
  Top 0.813: VR2.5 29.11,44.77 C8.1
  Bottom 0.406: v29.21,44.7 29.21,43.81 v36.83,36.2 37.47,36.83 40.64,36.83 45.72,31.75 JP13.2
SWV50  (via drill 0.3)
  Top 0.254: Q1.2 41.77,31.11
  Top 0.305: Q1.2 41.34,31.54 R21.1 36.83,29 36.83,27.94 36.59,27.7 RN2.7 | VR3.5 22.76,44.77 C9.1 v22.86,44.7 | 41.77,31.11 45.72,31.11 46.35,31.75 v46.35,33.02
  Bottom 0.305: v46.35,33.02 49.53,36.2 60.96,36.2
  Bottom 0.406: v22.86,44.7 24.51,46.35 59.05,46.35 60.96,44.45 60.96,36.2 JP12.6
USB_D+
  Top 0.254: IC5.37 10.31,27.79 10.16,27.94 X1.D+
USB_D-
  Top 0.254: IC5.36 11.09,28.29 10.63,28.74 X1.D-
USBID  (via drill 0.3)
  Top 0.254: IC5.33 17.84,29.79 17.14,30.48 v17.14,31.11
  Top 0.305: X1.ID 5.88,27.14 v5.08,27.94
  Bottom 0.305: v5.08,27.94 15.24,27.94 17.14,29.84 v17.14,31.11
USBLED  (via drill 0.3)
  Top 0.254: IC5.23 24.88,39.26 v24.13,40.01 | v7.87,40.01 R3.2
  Bottom 0.254: v24.13,40.01 v7.87,40.01
V+  (via drill 0.3)
  Top 0.254: R11.4 33.42,16.51 | C3.1 v35.18,13.97
  Top 0.305: C3.1 IC3.14 | 33.42,16.51 v31.75,16.51
  Top 0.813: R18.1 18.45,36.41 v18.41,36.45 16.13,36.45 15.88,36.2 R20.1
  Top 1.016: JP7.7 JP5.7 JP5.6 JP7.6
  Bottom 0.305: v31.75,16.51 31.75,13.97 | v35.18,13.97 31.75,13.97 | 31.75,13.97 31.75,6.99
  Bottom 0.61: v18.41,36.45 18.41,24.13 20.95,21.59 20.95,8.26 22.23,6.99 30.48,6.99 | 30.48,6.99 31.75,6.99 32.38,6.99 33.02,6.35 JP5.6 | JP5.7 30.48,6.99
  pour Top (isolate 0.305, no thermals): 11.43,34.04 16.45,34.04 17.02,34.6 17.02,44.65 18.8,44.65 18.8,45.97 19.3,46.48 23.93,46.48 24.28,46.1 24.28,44.7 25.17,44.7 25.17,46.74 24.54,47.37 15.7,47.37 14.83,46.48 14.83,44.65 16.64,44.65 16.64,42.98 14.83,42.98 14.83,36.07 14.45,35.69 11.68,35.69 11.43,35.43
VCC  (via drill 0.3)
  Top 0.254: C23.1 13.53,27.29 IC5.38 19.68,27.29 | C12.1 23.38,34.59 IC5.26 23.38,28.21 | JP9.2 35.56,42.55 27.73,34.71 C21.1 26.88,34.54 IC5.19 26.88,28.19 | 19.68,27.29 19.68,28.57 19.48,28.79 IC5.35 15.45,28.79 C13.1 | R2.2 v7.87,37.47 | C20.1 v33.4,24.77 31.38,26.79 IC5.10 | 19.68,27.29 22.46,27.29 23.38,28.21 | 23.38,28.21 26.87,28.21 26.88,28.19 | IC5.57 24.38,17.53 25.4,16.51 v27.94,16.51 | 26.88,28.19 v26.88,24.77 v26.87,24.77
  Top 0.305: 10.89,42.87 C7.1 10.79,38.1 10.16,37.47 v7.87,37.47 | R1.2 35.14,44.23 JP9.2 | v13.97,30.23 C13.1 | R15.2 R14.2 8.68,17.69 10.38,15.99 C19.2 U$5.8 13.26,9.6 13.97,8.89 v27.94,8.89
  Top 0.406: VR1.5 10.89,42.87
  Bottom 0.254: v33.4,24.77 v26.87,24.77 | 27.3,24.77 v26.87,24.77 | v26.87,24.77 26.87,17.58 v27.94,16.51
  Bottom 0.305: v7.87,37.47 7.87,36.32 v13.97,30.23 | v27.94,16.51 v27.94,8.89
VEXTERN
  Top 0.305: IC3.11 41.02,17.78 41.91,18.67 41.91,21.59 | 41.91,21.59 42.8,21.59 44.07,22.86 46.99,22.86 47.62,22.23 47.62,17.78 | 41.91,21.59 IC3.8 38.73,21.59 38.1,22.23 38.1,26.91 | 47.62,30.1 D1.C 48.9,35.56 49.53,36.2 62.87,36.2 63.5,35.56 63.5,32.38 62.87,31.75 JP12.5 | 47.62,30.1 D2.C | 47.62,17.78 47.62,14.61 46.99,13.97 IC3.1 | IC3.4 47.62,17.78 | 38.1,26.91 38.1,28.96 39.24,30.1 47.62,30.1 | RN2.6 38.1,26.91
VREGEN
  Top 0.254: IC5.22 25.38,40.66 24.77,41.27 | 24.77,41.27 24.77,42.84 VR2.3 | VR3.3 18.39,41.94 19.05,41.27 24.77,41.27

### Text on the board
tPlace: NORMAL | RESET | VREG | Mode | 1-Wire | UART | I2C | SPI | MODE | MOSI | OWD | TX | SDA | MOSI | CLK | SCL | CLK | !MLCR | +3V3 | GND | PGD | PGC | MISO | RX | MISO | USB | CS | CS | PWR | Self-test | +5V | Vpu | 3V3 | ADC | GND | +5V | 3V3 | Vpu | ADC | AUX2 | Unicorn_Bus_B | AUX1 | AUX | CS | MISO | CLK | MOSI | OWD | GND | SDA | SCL | GND | TXD | RXD | GND | 5V | GND
bPlace: SPI | I2C | UART | 1-Wire | Mode | MOSI | SDA | TX | OWD | MOSI | CLK | SCL | CLK | MISO | RX | MISO | CS | CS | ADC | 3V3 | Vpu | +5V | Self-test | GND | +5V | 3V3 | Vpu | ADC | AUX2 | Unicorn_Bus_B | AUX1 | AUX | CS | MISO | CLK | MOSI | OWD | GND | SDA | SCL | GND | TXD | RXD | GND
Reference: GND | +3v | +5v | ADC | USB | Vpu | AUX | CLK | MOSI | CS | MISO | I/O header | MCLR | +3.3V | GND | DATA | CLOCK